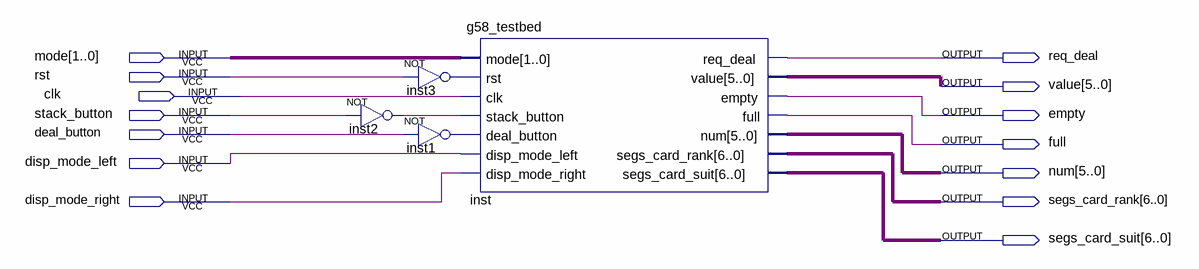
[diagram p0: schematic sheet]
// Quartus schematic g58_lab4_board.bdf as structural Verilog: 4 symbols, 14 pins
module g58_lab4_board (
  input  [1:0] mode,
  input  rst,
  input  clk,
  input  stack_button,
  input  deal_button,
  input  disp_mode_left,
  input  disp_mode_right,
  output req_deal,
  output [5:0] value,
  output empty,
  output full,
  output [5:0] num,
  output [6:0] segs_card_rank,
  output [6:0] segs_card_suit
);

  wire inst1_out, inst2_out, inst3_out;

  not inst2 (inst2_out, stack_button);
  not inst3 (inst3_out, rst);
  not inst1 (inst1_out, deal_button);
  g58_testbed inst (
    .mode(mode), .rst(inst3_out), .clk(clk), .stack_button(inst2_out), .deal_button(inst1_out),
    .disp_mode_left(disp_mode_left), .disp_mode_right(disp_mode_right), .req_deal(req_deal), .value(value),
    .empty(empty), .full(full), .num(num), .segs_card_rank(segs_card_rank), .segs_card_suit(segs_card_suit));
endmodule
